# Altium project Z1_Project.PrjPCB
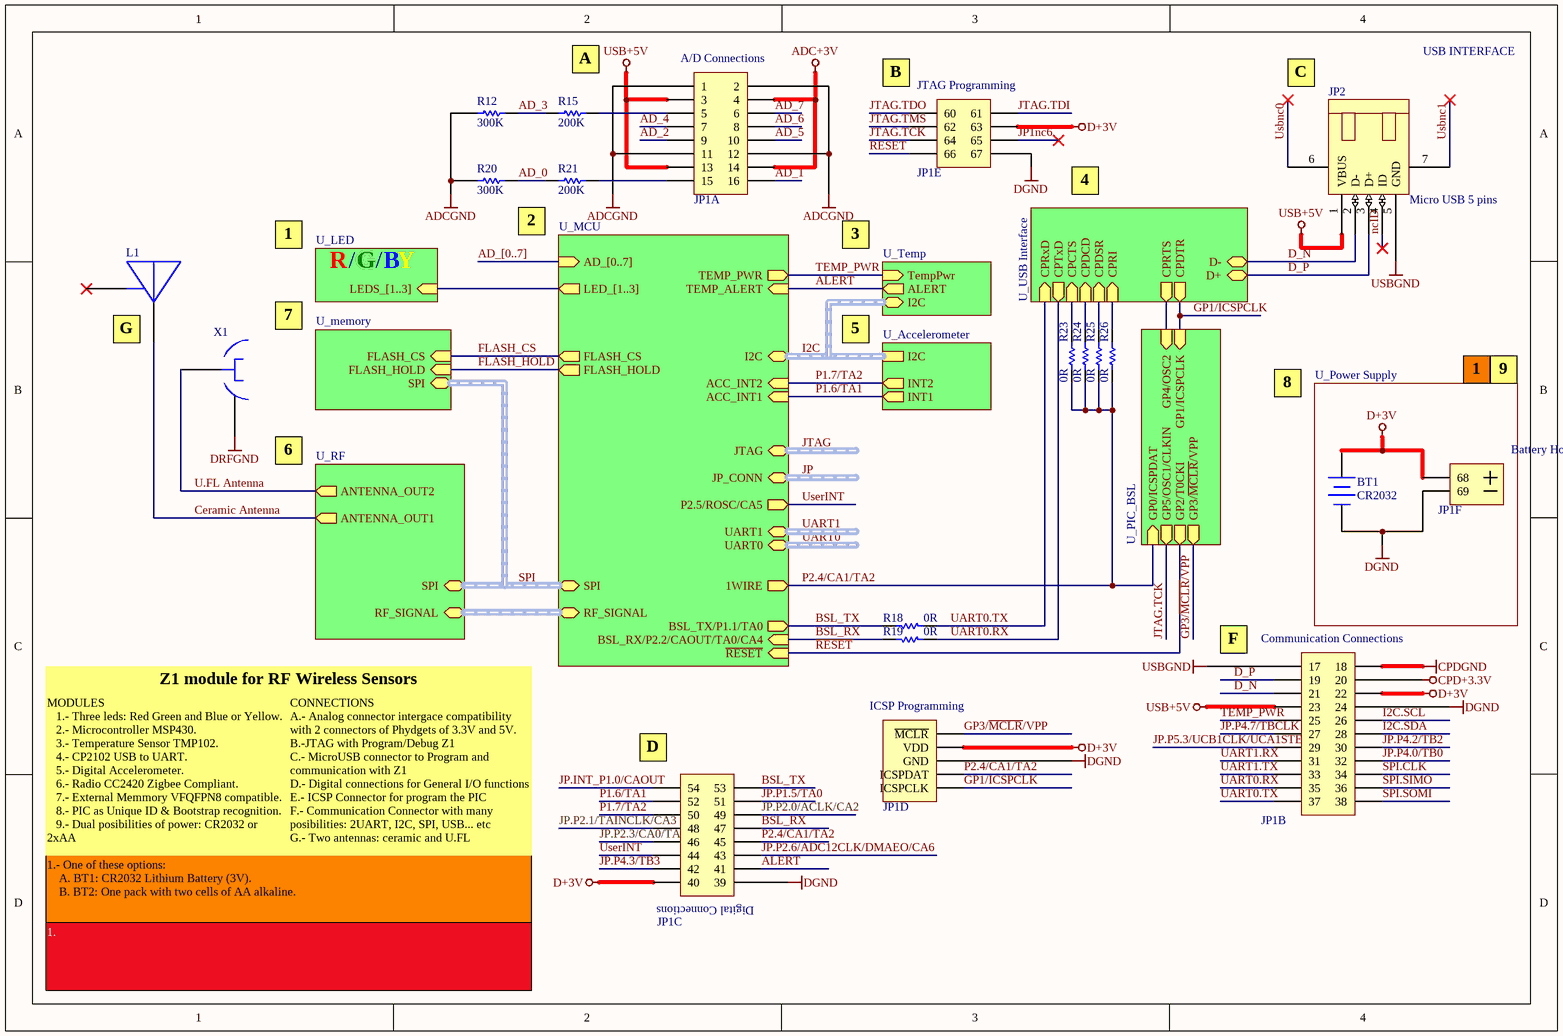
[diagram p0: Main Board.SchDoc]
10 sheets, 106 parts. Net scope: hierarchical (ports join the sheet entries above them; power ports are global).
Board file: Z1.PcbDoc
Sheets:
  Main Board.SchDoc
    U_RF = RF.SchDoc
    U_LED = LED.SchDoc
    U_memory = memory.SchDoc
    U_MCU = MCU.SchDoc
    U_Temp = Temp.SchDoc
    U_USB Interface = USB Interface.SchDoc
    U_Accelerometer = Accelerometer.SchDoc
    U_PIC_BSL = PIC_BSL.SchDoc
    U_Power Supply = Power Supply.SchDoc

## Sheet Main Board.SchDoc: Main Board
size A4; SheetNumber: 1; SheetTotal: 10; Project: WSN Z1; Comments: Main board; PageSetup: Record=PageOptions|CenterHorizontal=True|CenterVertical=True|PrintScale=0.97|XCorrection=1.00|YCorrection=1.00|PrintKind=1|BorderSize=5000000|LeftOffset=0|BottomOffset=0|Orientation=2|PaperLength=2970|PaperWidth=2100|Scale=100|PaperSource=7|PrintQuality=1200|MediaType=1|DitherType=10|PaperKind=A4|PrintScaleMode=1

### Parts
BT1  CR2032  [CR2032 - 796136-1]
JP1  Z1 Expansion Connector  [Z1 Expansion Connectors_RC2]  (value not drawn)  (parts A,B,C,D,E,F of 6)
JP2  Micro USB 5 pins  [ZX62D-B-5P8]
L1  Ceramic Antenna  [YAGEO - CAW431115300245]  (value not drawn)
R12  value 300K  [CR1005-0402]  (hidden comment: Res Semi)
R15  value 200K  [CR1005-0402]  (hidden comment: Res Semi)
R18  value 0R  [CR-0402-AL]  (hidden comment: Res Semi)
R19  value 0R  [CR-0402-AL]  (hidden comment: Res Semi)
R20  value 300K  [CR1005-0402]  (hidden comment: Res Semi)
R21  value 200K  [CR1005-0402]  (hidden comment: Res Semi)
R23  value 0R  [CR-0402-AL]  (hidden comment: Res Semi)
R24  value 0R  [CR-0402-AL]  (hidden comment: Res Semi)
R25  value 0R  [CR-0402-AL]  (hidden comment: Res Semi)
R26  value 0R  [CR-0402-AL]  (hidden comment: Res Semi)
X1  U.FL RF Connector  [U.FL]  (value not drawn)

### Sub-sheets
U_Accelerometer = Accelerometer.SchDoc: INT1 (out), INT2 (out), I2C (harness I2C)
U_LED = LED.SchDoc: LEDS_[1..3] (in)
U_MCU = MCU.SchDoc: 1WIRE (out), TEMP_ALERT (in), ACC_INT1 (in), ACC_INT2 (in), FLASH_CS (out), FLASH_HOLD (out), BSL_TX/P1.1/TA0 (out), BSL_RX/P2.2/CAOUT/TA0/CA4 (in), I2C (harness I2C), UART0 (harness UART0), UART1 (harness UART1), JTAG (harness JTAG), TEMP_PWR (out), ~{RESET} (in), AD_[0..7] (in), SPI (harness SPI), P2.5/ROSC/CA5 (out), LED_[1..3] (out), RF_SIGNAL (harness RADIO), JP_CONN (harness JP_CONN)
U_memory = memory.SchDoc: FLASH_CS (in), FLASH_HOLD (in), SPI (harness SPI)
U_PIC_BSL = PIC_BSL.SchDoc: GP0/ICSPDAT (in), GP2/T0CKI (out), GP1/ICSPCLK (in), GP4/OSC2 (in), GP5/OSC1/CLKIN (out), GP3/~{MCLR}/VPP (out)
U_Power Supply = Power Supply.SchDoc: no entries
U_RF = RF.SchDoc: ANTENNA_OUT2 (out), SPI (harness SPI), RF_SIGNAL (harness RADIO), ANTENNA_OUT1 (out)
U_Temp = Temp.SchDoc: ALERT (out), I2C (harness I2C), TempPwr (in)
U_USB Interface = USB Interface.SchDoc: CPRxD (in), CPTxD (out), CPRTS (out), CPCTS (in), CPDSR (in), CPDCD (in), CPDTR (out), CPRI (in), D- (bidir), D+ (bidir)

### Nets
ADC+3V: JP1.4 JP1.14
ADCGND: JP1.1 JP1.2 JP1.11 JP1.12 R12.2 R20.2
CPD+3.3V: JP1.20
CPDGND: JP1.18
D+3V: BT1.1(+) JP1.22 JP1.40 JP1.56(VDD) JP1.63 JP1.68
DGND: BT1.2(-) JP1.24 JP1.39 JP1.57(GND) JP1.67 JP1.69
DRFGND: X1.2(GND)
USB+5V: JP1.3 JP1.13 JP1.23 JP2.1(VBUS)
USBGND: JP1.17 JP2.5(GND)
AD_0: R20.1 R21.2
AD_1: JP1.16
AD_2: JP1.9
AD_3: R12.1 R15.2
AD_4: JP1.7
AD_5: JP1.10
AD_6: JP1.8
AD_7: JP1.6
ALERT: JP1.41 ; sheet U_MCU/TEMP_ALERT, sheet U_Temp/ALERT
BSL_RX: JP1.47 R19.2 ; sheet U_MCU/BSL_RX/P2.2/CAOUT/TA0/CA4
BSL_TX: JP1.53 R18.2 ; sheet U_MCU/BSL_TX/P1.1/TA0
Ceramic Antenna: L1.1(+) ; sheet U_RF/ANTENNA_OUT1
CPCTS: R23.1 ; sheet U_USB Interface/CPCTS
CPDCD: R24.1 ; sheet U_USB Interface/CPDCD
CPDSR: R25.1 ; sheet U_USB Interface/CPDSR
CPRI: R26.1 ; sheet U_USB Interface/CPRI
CPRTS: sheet U_USB Interface/CPRTS, sheet U_PIC_BSL/GP4/OSC2
D_N: JP1.21 JP2.2(D-) ; sheet U_USB Interface/D-
D_P: JP1.19 JP2.3(D+) ; sheet U_USB Interface/D+
FLASH_CS: sheet U_memory/FLASH_CS, sheet U_MCU/FLASH_CS
FLASH_HOLD: sheet U_memory/FLASH_HOLD, sheet U_MCU/FLASH_HOLD
GP1/ICSPCLK: JP1.59(ICSPCLK) ; sheet U_USB Interface/CPDTR, sheet U_PIC_BSL/GP1/ICSPCLK  [project net CPDTR]
GP3/~{MCLR}/VPP: JP1.55(~{MCLR}) ; sheet U_PIC_BSL/GP3/~{MCLR}/VPP
I2C.SCL: JP1.26
I2C.SDA: JP1.28
JP1nc6: JP1.65
JP.INT_P1.0/CAOUT: JP1.54
JP.P1.5/TA0: JP1.51
JP.P2.0/ACLK/CA2: JP1.49
JP.P2.1/TAINCLK/CA3: JP1.48
JP.P2.3/CA0/TA1: JP1.46
JP.P2.6/ADC12CLK/DMAEO/CA6: JP1.43
JP.P4.0/TB0: JP1.32
JP.P4.2/TB2: JP1.30
JP.P4.3/TB3: JP1.42
JP.P4.7/TBCLK: JP1.27
JP.P5.3/UCB1CLK/UCA1STE: JP1.29
JTAG.TCK: JP1.64 ; sheet U_PIC_BSL/GP5/OSC1/CLKIN  [project net GP5/OSC1/CLKIN]
JTAG.TDI: JP1.61
JTAG.TDO: JP1.60
JTAG.TMS: JP1.62
ncID: JP2.4(ID)
P1.6/TA1: JP1.52 ; sheet U_MCU/ACC_INT1, sheet U_Accelerometer/INT1  [project net INT1]
P1.7/TA2: JP1.50 ; sheet U_MCU/ACC_INT2, sheet U_Accelerometer/INT2  [project net INT2]
P2.4/CA1/TA2: JP1.45 JP1.58(ICSPDAT) R23.2 R24.2 R25.2 R26.2 ; sheet U_MCU/1WIRE, sheet U_PIC_BSL/GP0/ICSPDAT  [project net GP0/ICSPDAT]
~{RESET}: JP1.66 ; sheet U_MCU/~{RESET}, sheet U_PIC_BSL/GP2/T0CKI  [project net GP2/T0CKI]
SPI.CLK: JP1.34
SPI.SIMO: JP1.36
SPI.SOMI: JP1.38
TEMP_PWR: JP1.25 ; sheet U_MCU/TEMP_PWR, sheet U_Temp/TempPwr  [project net P5.0/UCB1STE/UCA1CLK]
U.FL Antenna: X1.1(+) ; sheet U_RF/ANTENNA_OUT2
UART0.RX: JP1.35 R19.1 ; sheet U_USB Interface/CPTxD  [project net CPTxD]
UART0.TX: JP1.37 R18.1 ; sheet U_USB Interface/CPRxD  [project net CPRxD]
UART1.RX: JP1.31
UART1.TX: JP1.33
Usbnc0: JP2.6(SH2)
Usbnc1: JP2.7(SH1)
UserINT: JP1.44 ; sheet U_MCU/P2.5/ROSC/CA5  [project net P2.5/ROSC/CA5]
NetJP1_5: JP1.5 R15.1
NetJP1_15: JP1.15 R21.1

Not connected (* = marked no-connect by the designer): L1 2(GND)*

### Buses and harness runs
bus AD_[0..7] = sheet U_MCU/AD_[0..7]
bus sheet U_LED/LEDS_[1..3] = sheet U_MCU/LED_[1..3]
harness I2C = sheet U_Accelerometer/I2C = sheet U_MCU/I2C = sheet U_Temp/I2C
harness JP = sheet U_MCU/JP_CONN
harness JTAG = sheet U_MCU/JTAG
harness sheet U_MCU/RF_SIGNAL = sheet U_RF/RF_SIGNAL
harness SPI = sheet U_MCU/SPI = sheet U_memory/SPI = sheet U_RF/SPI
harness UART0 = sheet U_MCU/UART0
harness UART1 = sheet U_MCU/UART1

### Notes on the sheet
- (near R15) A
- (near JP1) B
- C
- USB INTERFACE
- 1
- 2
- 3
- 4
- R
- /
- G
- B
- Y
- (near L1) G
- 7
- 5
- 9
- 8
- 6
- F
- Z1 module for RF Wireless Sensors
- (near JP1) D
- (near JP1) E
- MODULES
  1.- Three leds: Red Green and Blue or Yellow.
  2.- Microcontroller MSP430.
  3.- Temperature Sensor TMP102.
  4.- CP2102 USB to UART.
  5.- Digital Accelerometer.
  6.- Radio CC2420 Zigbee Compliant.
  7.- External Memmory VFQFPN8 compatible.
  8.- PIC as Unique ID & Bootstrap recognition.
  9.- Dual posibilities of power: CR2032 or 2xAA
- CONNECTIONS
  A.- Analog connector intergace compatibility with 2 connectors of Phydgets of 3.3V and 5V.
  B.-JTAG with Program/Debug Z1
  C.- MicroUSB connector to Program and communication with Z1
  D.- Digital connections for General I/O functions
  E.- ICSP Connector for program the PIC
  F.- Communication Connector with many posibilities: 2UART, I2C, SPI, USB... etc
  G.- Two antennas: ceramic and U.FL
- 1.- One of these options:
  A. BT1: CR2032 Lithium Battery (3V).
  B. BT2: One pack with two cells of AA alkaline.
- 1.
- (in symbol Z1_RC1, part A) A/D Connections
- (in symbol Z1_RC1, part B) Communication Connections
- (in symbol Z1_RC1, part C) Digital Connections
- (in symbol Z1_RC1, part D) ICSP Programming
- (in symbol Z1_RC1, part E) JTAG Programming
- (in symbol Z1_RC1, part F) Battery Holder

### Library data of the parts
BT1 = Battery: Multicell Battery; Value: +3.3V
JP1 = Z1_RC1
JP2 = USB 5 pins
L1 = 5.3x2.2 TDMA Antenna_1: ANT 2.4GHZ 802.11 BLUETOOTH SMD
R12 R15 R20 R21 R23-R26 = Res Semi: Semiconductor Resistor; Manufacturer: Generic Components
R18 R19 = Res Semi: RES ZERO OHM 1/10W 5% 0402 SMD
X1 = AntennaOmnidirectional: CONN RF MICROCOAXIAL SMD GOLD

## Sheet RF.SchDoc: Radio Frequency Module
size A4; SheetNumber: 3; SheetTotal: 10; Project: WSN Z1; Comments: RF Module; CurrentDate: 25/02/2008
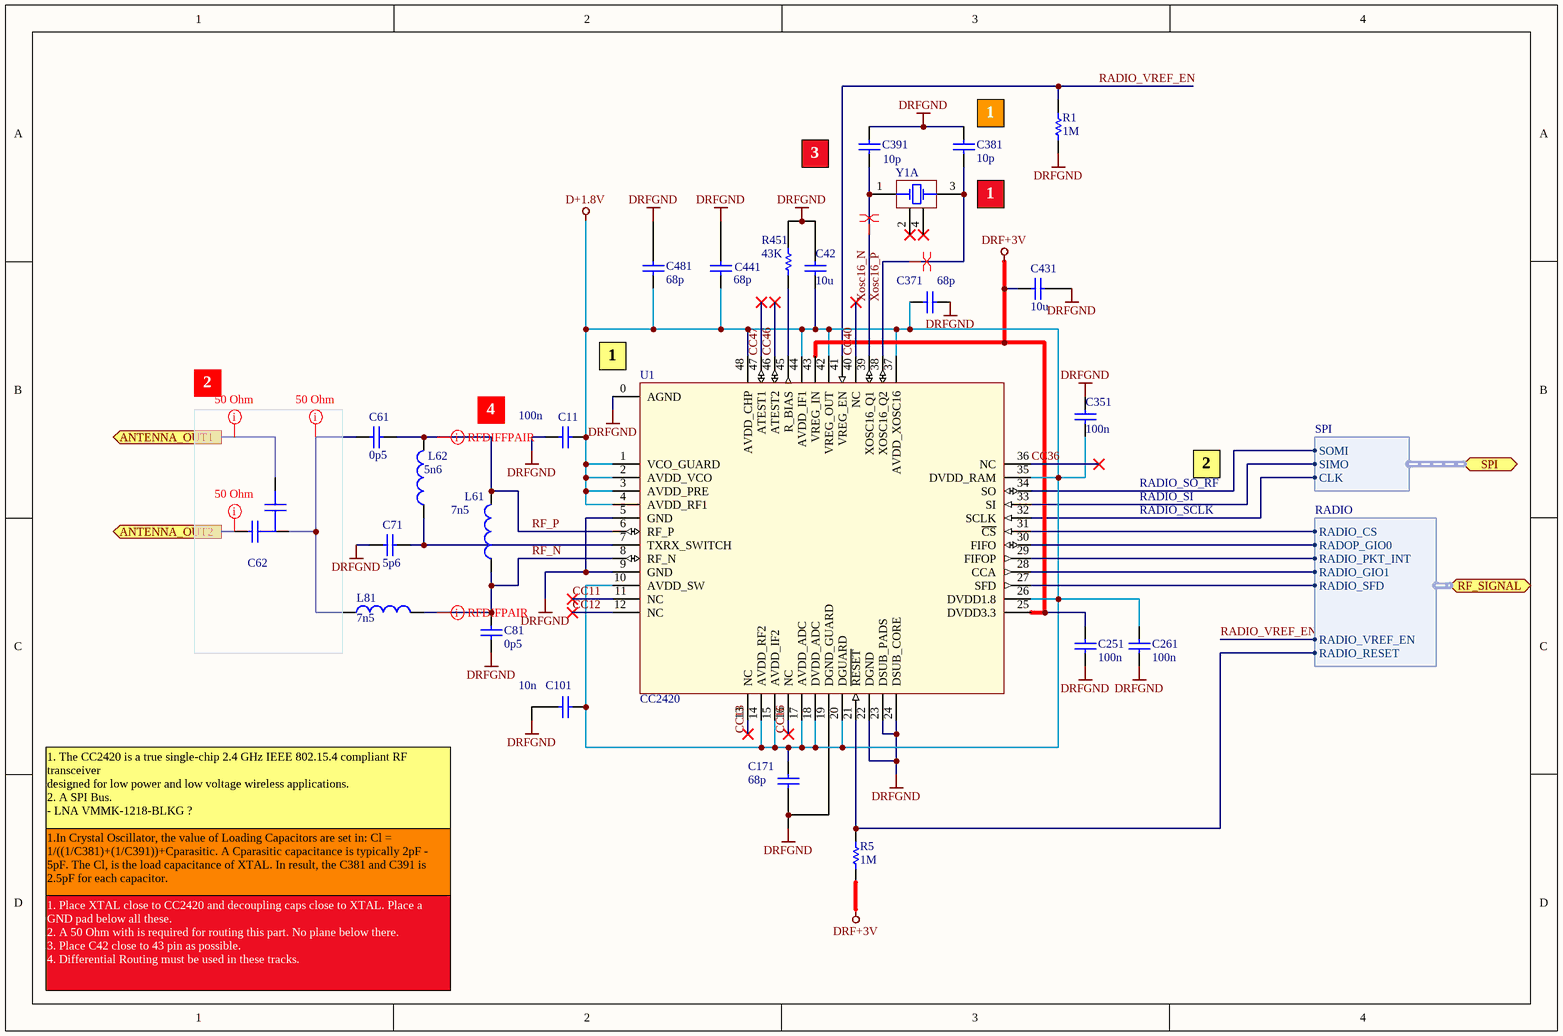
[diagram p1: RF.SchDoc]

### Parts
C11  value 100n  [CC-0402-AL]  (hidden comment: Cap Semi)
C42  value 10u  [CC2013-0805]  (hidden comment: Cap Semi)
C61  value 0p5  [CC-0402-AL]  (hidden comment: Cap Semi)
C62  Bilateral Switch Capacitor  [Dual Capacitor Switch]  (value not drawn)
C71  value 5p6  [CC-0402-AL]  (hidden comment: Cap Semi)
C81  value 0p5  [CC-0402-AL]  (hidden comment: Cap Semi)
C101  value 10n  [CC-0402-AL]  (hidden comment: Cap Semi)
C171  value 68p  [CC-0402-AL]  (hidden comment: Cap Semi)
C251  value 100n  [CC-0402-AL]  (hidden comment: Cap Semi)
C261  value 100n  [CC-0402-AL]  (hidden comment: Cap Semi)
C351  value 100n  [CC-0402-AL]  (hidden comment: Cap Semi)
C371  value 68p  [CC-0402-AL]  (hidden comment: Cap Semi)
C381  value 10p  [CC-0402-AL]  (hidden comment: Cap Semi)
C391  value 10p  [CC-0402-AL]  (hidden comment: Cap Semi)
C431  value 10u  [CC2013-0805]  (hidden comment: Cap Semi)
C441  value 68p  [CC-0402-AL]  (hidden comment: Cap Semi)
C481  value 68p  [CC-0402-AL]  (hidden comment: Cap Semi)
L61  value 7n5  [INDC1005-0402-ALT]  (hidden comment: Inductor)
L62  value 5n6  [INDC1005-0402]  (hidden comment: Inductor)
L81  value 7n5  [INDC1005-0402]  (hidden comment: Inductor)
R1  value 1M  [CR-0402-AL]  (hidden comment: Res Semi)
R5  value 1M  [CR-0402-AL]  (hidden comment: Res Semi)
R451  value 43K  [CR-0402-AL]  (hidden comment: Res Semi)
U1  CC2420  [QFN7X7-48]
Y1  XTAL 4pins  [NX3225SA- 16.000000Hhz-B3]  (value not drawn)  (part A of 2)

### Ports
ANTENNA_OUT1 (out), ANTENNA_OUT2 (out), RF_SIGNAL (harness RADIO), SPI (harness SPI)

### Harnesses
SPI: CLK, SOMI, SIMO
RADIO: RADIO_RESET, RADIO_VREF_EN, RADIO_SFD, RADIO_PKT_INT, RADOP_GIO0, RADIO_GIO1, RADIO_CS

### Nets
D+1.8V: C11.2 C42.1 C101.2 C171.1 C261.1 C351.1 C371.1 C441.1 C481.1 U1.1(VCO_GUARD) U1.2(AVDD_VCO) U1.3(AVDD_PRE) U1.4(AVDD_RF1) U1.10(AVDD_SW) U1.14(AVDD_RF2) U1.15(AVDD_IF2) U1.17(AVDD_ADC) U1.18(DVDD_ADC) U1.20(DGUARD) U1.26(DVDD1.8) U1.35(DVDD_RAM) U1.37(AVDD_XOSC16) U1.42(VREG_OUT) U1.44(AVDD_IF1) U1.48(AVDD_CHP)
DRF+3V: C251.1 C431.2 R5.1 U1.25(DVDD3.3) U1.43(VREG_IN)
DRFGND: C11.1 C42.2 C71.2 C81.1 C101.1 C171.2 C251.2 C261.2 C351.2 C371.2 C381.2 C391.2 C431.1 C441.2 C481.2 R1.1 R451.2 U1.0(AGND) U1.5(GND) U1.9(GND) U1.19(DGND_GUARD) U1.22(DGND) U1.23(DSUB_PADS) U1.24(DSUB_CORE)
CC11: U1.11(NC)
CC12: U1.12(NC)
CC13: U1.13(NC)
CC16: U1.16(NC)
CC36: U1.36(NC)
CC40: U1.40(NC)
CC46: U1.46(ATEST2)
CC47: U1.47(ATEST1)
Ceramic Antenna: C62.3 ; port ANTENNA_OUT1
P1.2/TA1: U1.29(FIFOP) ; port RF_SIGNAL.RADIO_PKT_INT
P1.3/TA2: U1.30(FIFO) ; port RF_SIGNAL.RADOP_GIO0
P1.4/SMCLK: U1.28(CCA) ; port RF_SIGNAL.RADIO_GIO1
P3.0/UCB0STE/UCA0CLK: U1.31(~{CS}) ; port RF_SIGNAL.RADIO_CS
P3.1/UCB0SIMO/UCB0SDA: U1.33(SI) ; port SPI.SIMO
P3.2/UCB0SOMI/UCB0SCL: U1.34(SO) ; port SPI.SOMI
P3.3/UCB0CLK/UCA0STE: U1.32(SCLK) ; port SPI.CLK
P4.1/TB1: U1.27(SFD) ; port RF_SIGNAL.RADIO_SFD
P4.6/TB6: R5.2 U1.21(~{RESET}) ; port RF_SIGNAL.RADIO_RESET
RADIO_VREF_EN: R1.2 U1.41(VREG_EN) ; port RF_SIGNAL.RADIO_VREF_EN  [project net P4.5/TB5]
RF_N: C81.2 L61.1 L81.2 U1.8(RF_N)
RF_P: C61.1 L61.2 L62.2 U1.6(RF_P)
U.FL Antenna: C62.2 ; port ANTENNA_OUT2
Xosc16_N: C391.1 U1.39(XOSC16_Q1) Y1.1(OSC1)
Xosc16_P: C381.1 U1.38(XOSC16_Q2) Y1.3(OSC2)
NetC61_2: C61.2 C62.1 L81.1
NetC71_1: C71.1 L62.1 U1.7(TXRX_SWITCH)
NetR451_1: R451.1 U1.45(R_BIAS)

Not connected (* = marked no-connect by the designer): Y1 2(GND)* 4(GND)*

### Layout directives
differential pair; rule Differential Pairs Routing [Pref Gap = 0.254mm    Min Gap  = 0.15mm    Max Gap  = 0.5mm]: RF_N, RF_P, Xosc16_N, Xosc16_P
rule Width Constraint [Pref Width = 0.254mm    Min Width = 0.01mm    Max Width = 3mm]: Ceramic Antenna, NetC61_2, U.FL Antenna

### Notes on the sheet
- (near C391) 3
- (near C381) 1
- 1
- (near U1) 1
- 2
- 4
- RADIO_SCLK
- RADIO_SI
- RADIO_SO_RF
- 1. The CC2420 is a true single-chip 2.4 GHz IEEE 802.15.4 compliant RF transceiver
  designed for low power and low voltage wireless applications.
  2. A SPI Bus.
  - LNA VMMK-1218-BLKG ?
- 1.In Crystal Oscillator, the value of Loading Capacitors are set in: Cl = 1/((1/C381)+(1/C391))+Cparasitic. A Cparasitic capacitance is typically 2pF - 5pF. The Cl, is the load capacitance of XTAL. In result, the C381 and C391 is 2.5pF for each capacitor.
- 1. Place XTAL close to CC2420 and decoupling caps close to XTAL. Place a GND pad below all these.
  2. A 50 Ohm with is required for routing this part. No plane below there.
  3. Place C42 close to 43 pin as possible.
  4. Differential Routing must be used in these tracks.

### Library data of the parts
C11 C42 C61 C71 C81 C101 C171 C251 C261 C351 C371 C381 C391 C431 C441 C481 = Cap Semi: Capacitor (Semiconductor SIM Model)
C62 = Bilateral Switch Capacitor: Value: 5p6
R1 R5 = Res Semi: as R12 on sheet Main Board
R451 = Res Semi: RES 43.0K OHM 1/16W 1% 0402 SMD; Manufacturer: Generic Components
U1 = CC2420: 2.4 GHz IEEE 802.15.4 / ZigBee-ready RF Transceiver
Y1 = XTAL 4pins: XTAL 7.2pF Load Capacitance.; Manufacturer: Generic Components; Value: 16Mhz

## Sheet LED.SchDoc: Led Interface
size A4; SheetNumber: 7; SheetTotal: 10; Project: WSN Z1; Comments: Led Interface
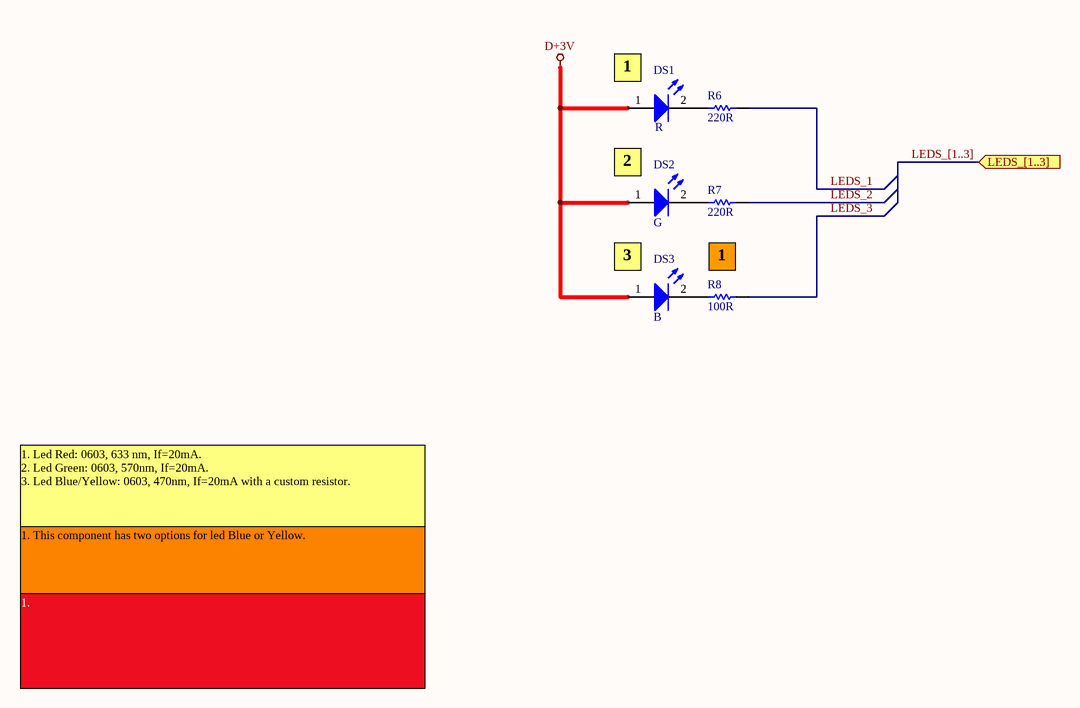
[diagram p2: LED.SchDoc]

### Parts
DS1  R  [LED0603]
DS2  G  [LED0603]
DS3  B  [LED0603]
R6  value 220R  [CR-0402-AL]  (hidden comment: Res Semi)
R7  value 220R  [CR-0402-AL]  (hidden comment: Res Semi)
R8  value 100R  [CR-0402-AL]  (hidden comment: Res Semi)

### Ports
LEDS_[1..3] (in)

### Nets
D+3V: DS1.1(A) DS2.1(A) DS3.1(A)
LEDS_1: R6.1  [project net LED1]
LEDS_2: R7.2  [project net LED2]
LEDS_3: R8.2  [project net LED3]
NetDS1_2: DS1.2(K) R6.2
NetDS2_2: DS2.2(K) R7.1
NetDS3_2: DS3.2(K) R8.1

### Buses and harness runs
bus LEDS_[1..3] = port LEDS_[1..3]

### Notes on the sheet
- (near DS1) 1
- 2
- 3
- 1
- 1. Led Red: 0603, 633 nm, If=20mA.
  2. Led Green: 0603, 570nm, If=20mA.
  3. Led Blue/Yellow: 0603, 470nm, If=20mA with a custom resistor.
- 1. This component has two options for led Blue or Yellow.
- 1.

### Library data of the parts
DS1 = LED2: LED 1.6X0.8MM 631NM RED CLR SMD
DS2 = LED2: LED CHIPLED 570NM GREEN 0603 SMD
DS3 = LED2: LED 1.6X0.8MM 470NM BLUE CLR SMD
R6-R8 = Res Semi: as R12 on sheet Main Board

## Sheet memory.SchDoc: Memmory interface
size A4; SheetNumber: 10; SheetTotal: 10; Project: WSN Z1; Comments: M25P* EEPROMS
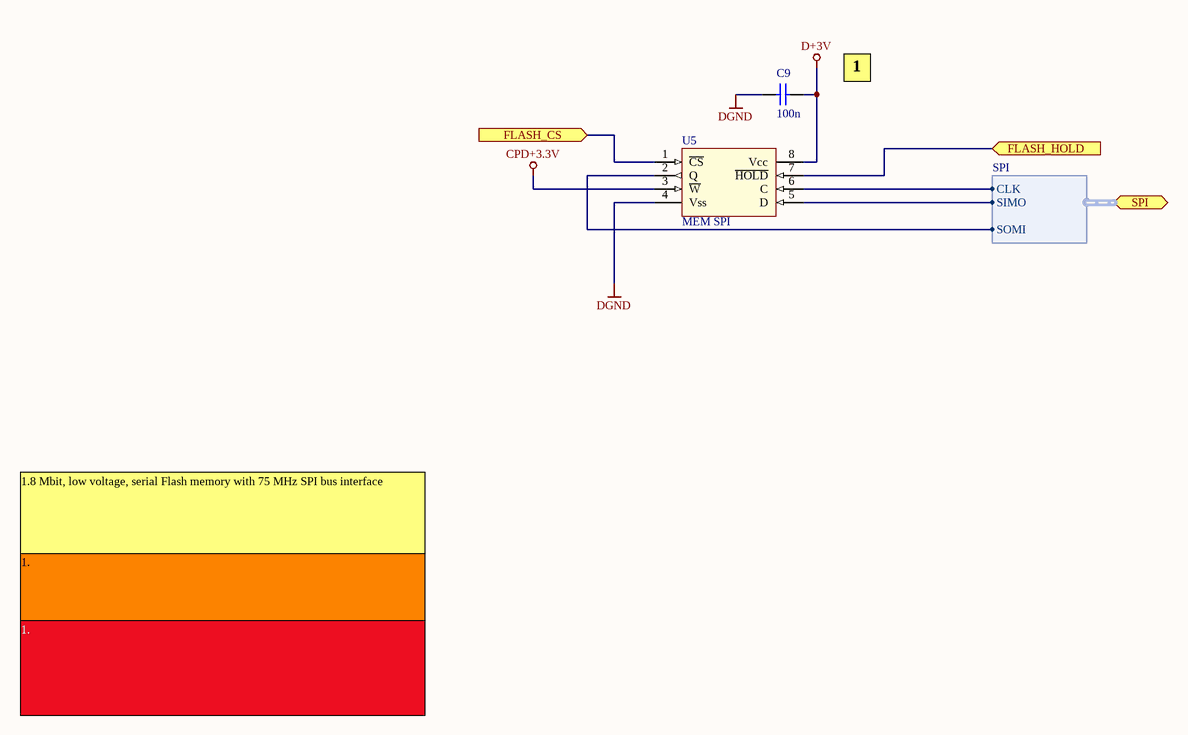
[diagram p3: memory.SchDoc]

### Parts
C9  value 100n  [CC-0402-AL]  (hidden comment: Cap Semi)
U5  MEM SPI  [VFQFPN8]

### Ports
FLASH_CS (in), FLASH_HOLD (in), SPI (harness SPI)

### Harnesses
SPI: CLK, SOMI, SIMO

### Nets
CPD+3.3V: U5.3(~{W})
D+3V: C9.2 U5.8(Vcc)
DGND: C9.1 U5.4(Vss)
FLASH_CS: U5.1(~{CS}) ; port FLASH_CS
FLASH_HOLD: U5.7(~{HOLD}) ; port FLASH_HOLD
P3.1/UCB0SIMO/UCB0SDA: U5.5(D) ; port SPI.SIMO
P3.2/UCB0SOMI/UCB0SCL: U5.2(Q) ; port SPI.SOMI
P3.3/UCB0CLK/UCA0STE: U5.6(C) ; port SPI.CLK

### Notes on the sheet
- 1
- 1.8 Mbit, low voltage, serial Flash memory with 75 MHz SPI bus interface
- 1.

### Library data of the parts
C9 = Cap Semi: Capacitor (Semiconductor SIM Model)
U5 = M25P80: 8 Mbit, low voltage, serial Flash memory  with 75 MHz SPI bus interface

## Sheet MCU.SchDoc: Microcontroller
size A4; SheetNumber: 2; SheetTotal: 10; Project: WSN Z1; Comments: MSP430 16-Bit; PageSetup: Record=PageOptions|CenterHorizontal=True|CenterVertical=True|PrintScale=0.97|XCorrection=1.00|YCorrection=1.00|PrintKind=1|BorderSize=5000000|LeftOffset=0|BottomOffset=0|Orientation=2|PaperLength=2970|PaperWidth=2100|Scale=100|PaperSource=7|PrintQuality=1200|MediaType=1|DitherType=10|PaperKind=A4|PrintScaleMode=1
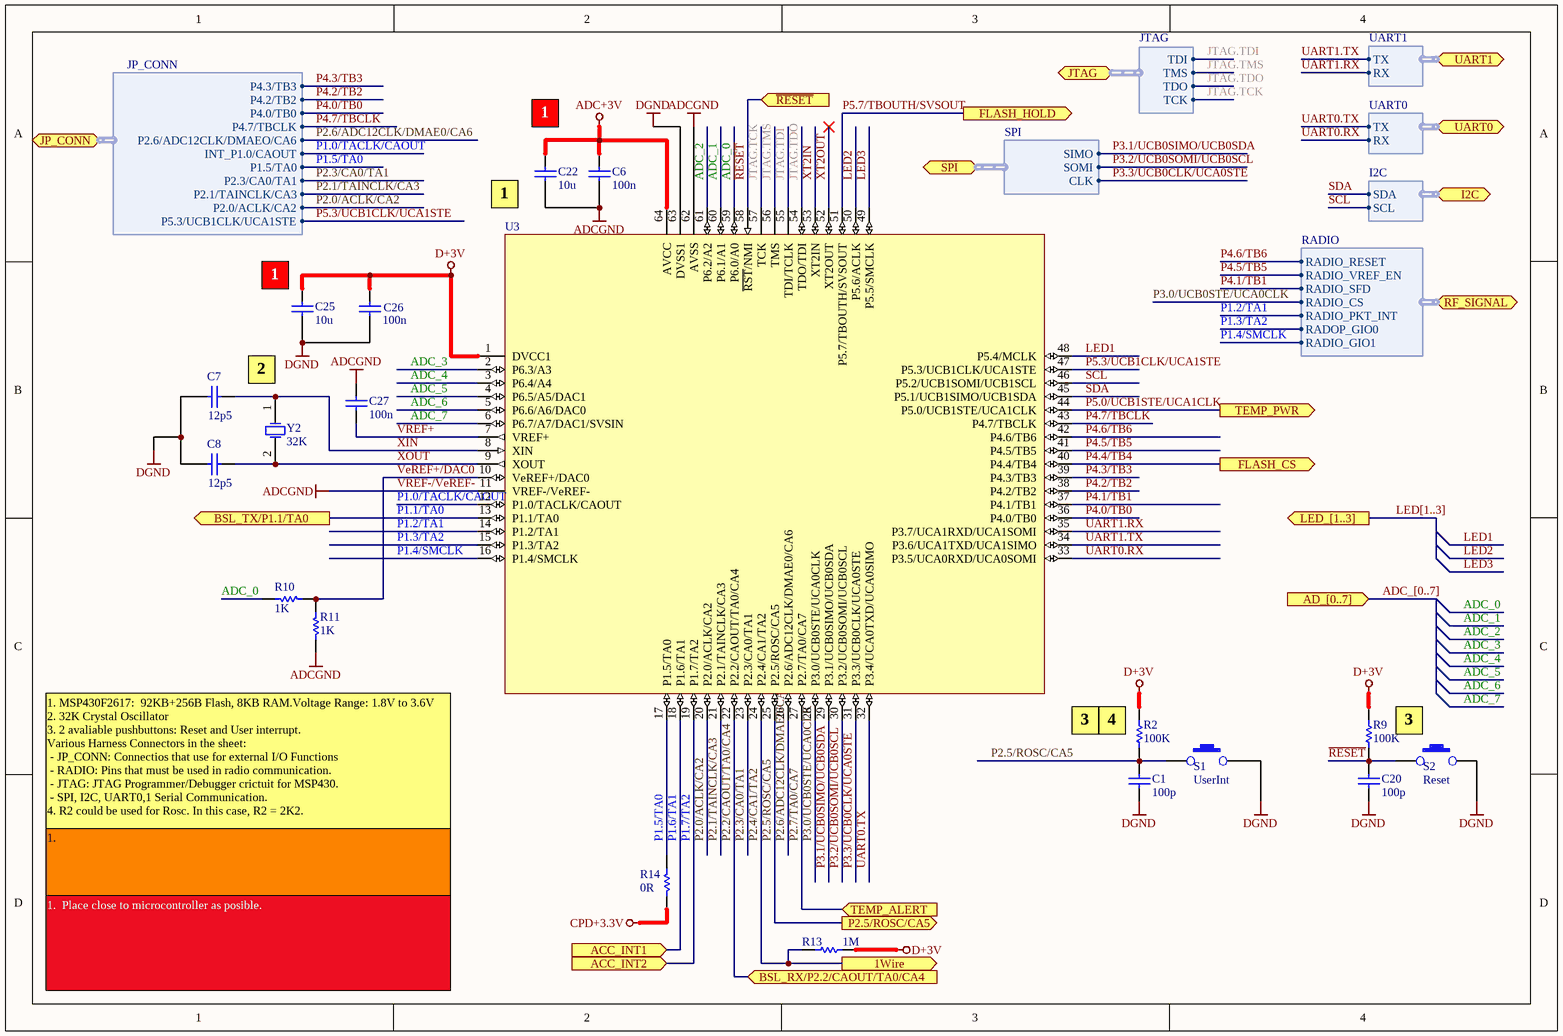
[diagram p4: MCU.SchDoc]

### Parts
C1  value 100p  [CC-0402-AL]  (hidden comment: Cap Semi)
C6  value 100n  [CC-0402-AL]  (hidden comment: Cap Semi)
C7  value 12p5  [CC-0402-AL]  (hidden comment: Cap Semi)
C8  value 12p5  [CC-0402-AL]  (hidden comment: Cap Semi)
C20  value 100p  [CC-0402-AL]  (hidden comment: Cap Semi)
C22  value 10u  [CC1608-0603]  (hidden comment: Cap Semi)
C25  value 10u  [CC1608-0603]  (hidden comment: Cap Semi)
C26  value 100n  [CC-0402-AL]  (hidden comment: Cap Semi)
C27  value 100n  [CC-0402-AL]  (hidden comment: Cap Semi)
R2  value 100K  [CR1005-0402]  (hidden comment: Res Semi)
R9  value 100K  [CR-0402-AL]  (hidden comment: Res Semi)
R10  value 1K  [CR-0402-AL]  (hidden comment: Res Semi)
R11  value 1K  [CR-0402-AL]  (hidden comment: Res Semi)
R13  value 1M  [CR-0402-AL]  (hidden comment: Res Semi)
R14  value 0R  [CR-0402-AL]  (hidden comment: Res Semi)
S1  UserInt  [B3U-1000P]
S2  Reset  [B3U-1000P]
U3  MSP430F2617TPMR  [F-QFP10x10-G64/N]  (value not drawn)
Y2  32K  [ABS07-32.768KHZ-7-T]

### Ports
1Wire (out), ACC_INT1 (in), ACC_INT2 (in), AD_[0..7] (in), BSL_RX/P2.2/CAOUT/TA0/CA4 (in), BSL_TX/P1.1/TA0 (out), FLASH_CS (out), FLASH_HOLD (out), I2C (harness I2C), JP_CONN (harness JP_CONN), JTAG (harness JTAG), LED_[1..3] (out), P2.5/ROSC/CA5 (out), RF_SIGNAL (harness RADIO), SPI (harness SPI), TEMP_ALERT (in), TEMP_PWR (out), UART0 (harness UART0), UART1 (harness UART1), ~{RESET} (in)

### Harnesses
I2C: SCL, SDA
UART0: RX, TX
UART1: RX, TX
JTAG: TCK, TDI, TDO, TMS
SPI: CLK, SOMI, SIMO
RADIO: RADIO_RESET, RADIO_VREF_EN, RADIO_SFD, RADIO_PKT_INT, RADOP_GIO0, RADIO_GIO1, RADIO_CS
JP_CONN: P2.0/ACLK/CA2, P2.1/TAINCLK/CA3, P2.3/CA0/TA1, P1.5/TA0, INT_P1.0/CAOUT, P2.6/ADC12CLK/DMAEO/CA6, P4.7/TBCLK, P4.0/TB0, P4.2/TB2, P4.3/TB3, P5.3/UCB1CLK/UCA1STE

### Nets
ADC+3V: C6.1 C22.1 U3.64(AVCC)
ADCGND: C6.2 C22.2 C27.1 R11.1 U3.11(VREF-/VeREF-) U3.62(AVSS)
CPD+3.3V: R14.1
D+3V: C25.1 C26.1 R2.1 R9.2 R13.1 U3.1(DVCC1)
DGND: C1.2 C7.1 C8.1 C20.2 C25.2 C26.2 S1.2 S2.2 U3.63(DVSS1)
ADC_0: R10.2 U3.59(P6.0/A0)  [project net AD_0]
ADC_1: U3.60(P6.1/A1)  [project net AD_1]
ADC_2: U3.61(P6.2/A2)  [project net AD_2]
ADC_3: U3.2(P6.3/A3)  [project net AD_3]
ADC_4: U3.3(P6.4/A4)  [project net AD_4]
ADC_5: U3.4(P6.5/A5/DAC1)  [project net AD_5]
ADC_6: U3.5(P6.6/A6/DAC0)  [project net AD_6]
ADC_7: U3.6(P6.7/A7/DAC1/SVSIN)  [project net AD_7]
JTAG.TCK: U3.57(TCK) ; port JTAG.TCK
JTAG.TDI: U3.55(TDI/TCLK) ; port JTAG.TDI
JTAG.TDO: U3.54(TDO/TDI) ; port JTAG.TDO
JTAG.TMS: U3.56(TMS) ; port JTAG.TMS
LED1: U3.48(P5.4/MCLK)
LED2: U3.50(P5.6/ACLK)
LED3: U3.49(P5.5/SMCLK)
P1.0/TACLK/CAOUT: U3.12(P1.0/TACLK/CAOUT) ; port JP_CONN.INT_P1.0/CAOUT  [project net JP.INT_P1.0/CAOUT]
P1.1/TA0: U3.13(P1.1/TA0) ; port BSL_TX/P1.1/TA0  [project net BSL_TX]
P1.2/TA1: U3.14(P1.2/TA1) ; port RF_SIGNAL.RADIO_PKT_INT
P1.3/TA2: U3.15(P1.3/TA2) ; port RF_SIGNAL.RADOP_GIO0
P1.4/SMCLK: U3.16(P1.4/SMCLK) ; port RF_SIGNAL.RADIO_GIO1
P1.5/TA0: R14.2 U3.17(P1.5/TA0) ; port JP_CONN.P1.5/TA0  [project net JP.P1.5/TA0]
P1.6/TA1: U3.18(P1.6/TA1) ; port ACC_INT1  [project net INT1]
P1.7/TA2: U3.19(P1.7/TA2) ; port ACC_INT2  [project net INT2]
P2.0/ACLK/CA2: U3.20(P2.0/ACLK/CA2) ; port JP_CONN.P2.0/ACLK/CA2  [project net JP.P2.0/ACLK/CA2]
P2.1/TAINCLK/CA3: U3.21(P2.1/TAINCLK/CA3) ; port JP_CONN.P2.1/TAINCLK/CA3  [project net JP.P2.1/TAINCLK/CA3]
P2.2/CAOUT/TA0/CA4: U3.22(P2.2/CAOUT/TA0/CA4) ; port BSL_RX/P2.2/CAOUT/TA0/CA4  [project net BSL_RX]
P2.3/CA0/TA1: U3.23(P2.3/CA0/TA1) ; port JP_CONN.P2.3/CA0/TA1  [project net JP.P2.3/CA0/TA1]
P2.4/CA1/TA2: R13.2 U3.24(P2.4/CA1/TA2) ; port 1Wire  [project net GP0/ICSPDAT]
P2.5/ROSC/CA5: C1.1 R2.2 S1.1 U3.25(P2.5/ROSC/CA5) ; port P2.5/ROSC/CA5
P2.6/ADC12CLK/DMAE0/CA6: U3.26(P2.6/ADC12CLK/DMAE0/CA6) ; port JP_CONN.P2.6/ADC12CLK/DMAEO/CA6  [project net JP.P2.6/ADC12CLK/DMAEO/CA6]
P2.7/TA0/CA7: U3.27(P2.7/TA0/CA7) ; port TEMP_ALERT  [project net ALERT]
P3.0/UCB0STE/UCA0CLK: U3.28(P3.0/UCB0STE/UCA0CLK) ; port RF_SIGNAL.RADIO_CS
P3.1/UCB0SIMO/UCB0SDA: U3.29(P3.1/UCB0SIMO/UCB0SDA) ; port SPI.SIMO
P3.2/UCB0SOMI/UCB0SCL: U3.30(P3.2/UCB0SOMI/UCB0SCL) ; port SPI.SOMI
P3.3/UCB0CLK/UCA0STE: U3.31(P3.3/UCB0CLK/UCA0STE) ; port SPI.CLK
P4.0/TB0: U3.36(P4.0/TB0) ; port JP_CONN.P4.0/TB0  [project net JP.P4.0/TB0]
P4.1/TB1: U3.37(P4.1/TB1) ; port RF_SIGNAL.RADIO_SFD
P4.2/TB2: U3.38(P4.2/TB2) ; port JP_CONN.P4.2/TB2  [project net JP.P4.2/TB2]
P4.3/TB3: U3.39(P4.3/TB3) ; port JP_CONN.P4.3/TB3  [project net JP.P4.3/TB3]
P4.4/TB4: U3.40(P4.4/TB4) ; port FLASH_CS  [project net FLASH_CS]
P4.5/TB5: U3.41(P4.5/TB5) ; port RF_SIGNAL.RADIO_VREF_EN
P4.6/TB6: U3.42(P4.6/TB6) ; port RF_SIGNAL.RADIO_RESET
P4.7/TBCLK: U3.43(P4.7/TBCLK) ; port JP_CONN.P4.7/TBCLK  [project net JP.P4.7/TBCLK]
P5.0/UCB1STE/UCA1CLK: U3.44(P5.0/UCB1STE/UCA1CLK) ; port TEMP_PWR
P5.3/UCB1CLK/UCA1STE: U3.47(P5.3/UCB1CLK/UCA1STE) ; port JP_CONN.P5.3/UCB1CLK/UCA1STE  [project net JP.P5.3/UCB1CLK/UCA1STE]
P5.7/TBOUTH/SVSOUT: U3.51(P5.7/TBOUTH/SVSOUT) ; port FLASH_HOLD  [project net FLASH_HOLD]
~{RESET}: C20.1 R9.1 S2.1 U3.58(~{RST}/NMI) ; port ~{RESET}  [project net GP2/T0CKI]
SCL: U3.46(P5.2/UCB1SOMI/UCB1SCL) ; port I2C.SCL  [project net I2C.SCL]
SDA: U3.45(P5.1/UCB1SIMO/UCB1SDA) ; port I2C.SDA  [project net I2C.SDA]
UART0.RX: U3.33(P3.5/UCA0RXD/UCA0SOMI) ; port UART0.RX
UART0.TX: U3.32(P3.4/UCA0TXD/UCA0SIMO) ; port UART0.TX
UART1.RX: U3.35(P3.7/UCA1RXD/UCA1SOMI) ; port UART1.RX
UART1.TX: U3.34(P3.6/UCA1TXD/UCA1SIMO) ; port UART1.TX
VeREF+/DAC0: R10.1 R11.2 U3.10(VeREF+/DAC0)
VREF+: C27.2 U3.7(VREF+)
XIN: C7.2 U3.8(XIN) Y2.1(OSC1)
XOUT: C8.2 U3.9(XOUT) Y2.2(OSC2)
XT2IN: U3.53(XT2IN)
XT2OUT: U3.52(XT2OUT)

### Buses and harness runs
bus ADC_[0..7] = port AD_[0..7]
bus LED[1..3] = port LED_[1..3]

### Notes on the sheet
- 1
- (near C25) 1
- 2
- (near U3) VREF-/VeREF-
- 3
- (near R2) 4
- 1. MSP430F2617:  92KB+256B Flash, 8KB RAM.Voltage Range: 1.8V to 3.6V
  2. 32K Crystal Oscillator
  3. 2 avaliable pushbuttons: Reset and User interrupt.
  Various Harness Connectors in the sheet:
  - JP_CONN: Connectios that use for external I/O Functions
  - RADIO: Pins that must be used in radio communication.
  - JTAG: JTAG Programmer/Debugger crictuit for MSP430.
  - SPI, I2C, UART0,1 Serial Communication.
  4. R2 could be used for Rosc. In this case, R2 = 2K2.
- 1.
- 1.  Place close to microcontroller as posible.

### Library data of the parts
C1 C6-C8 C20 C26 C27 = Cap Semi: Capacitor (Semiconductor SIM Model)
C22 C25 = Cap Semi: CAP CER 10UF 6.3V X5R 0603
R2 = Res Semi: as R12 on sheet Main Board
R9-R11 R13 R14 = Res Semi: Semiconductor Resistor
S1 S2 = B3U-1000P: Ultra-small Tactile Switch
U3 = MSP430F2617TPMR: MSP430F2617TPMR MICROCONTROLLER
Y2 = XTAL: Crystal Oscillator; Manufacturer: Generic Components; Value: 32Khz

## Sheet Temp.SchDoc: Temperature sensor
size A4; SheetNumber: 5; SheetTotal: 10; Project: WSN Z1; Comments: Temperatire sensor
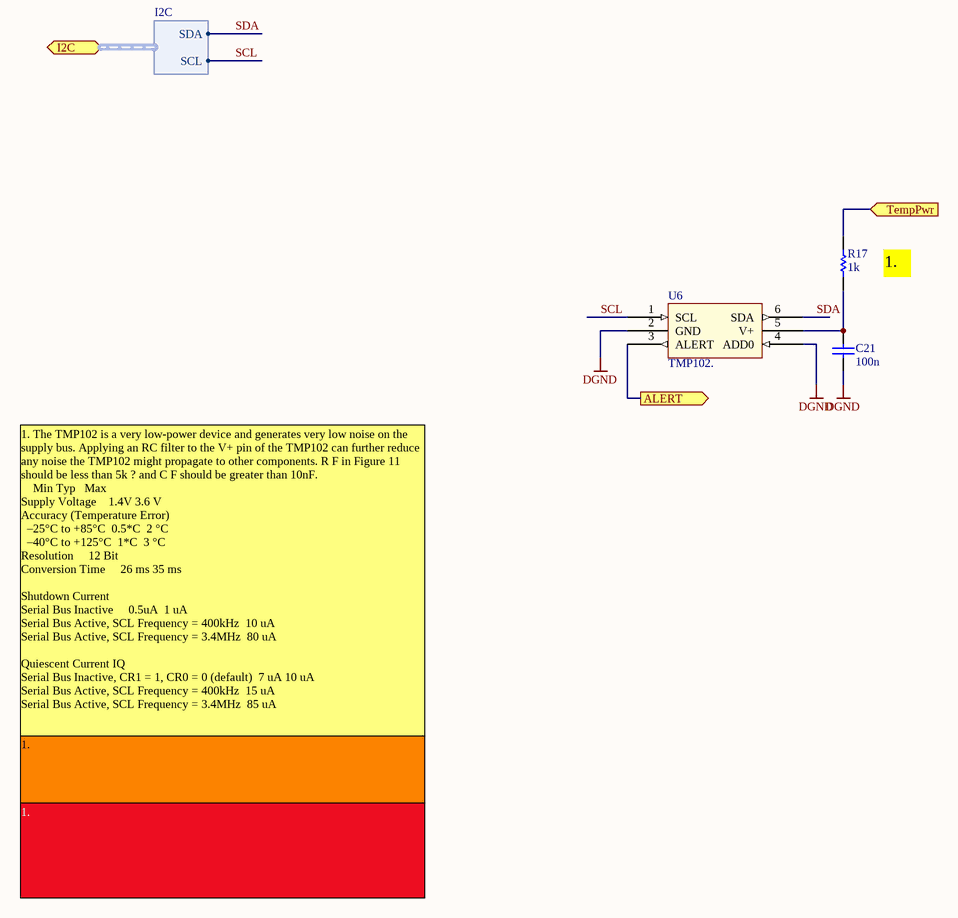
[diagram p5: Temp.SchDoc]

### Parts
C21  value 100n  [CC-0402-AL]  (hidden comment: Cap Semi)
R17  value 1k  [CR-0402-AL]  (hidden comment: Res Semi)
U6  TMP102.  [SOT-TMP102]

### Ports
ALERT (out), I2C (harness I2C), TempPwr (in)

### Harnesses
I2C: SCL, SDA

### Nets
DGND: C21.2 U6.2(GND) U6.4(ADD0)
ALERT: U6.3(ALERT) ; port ALERT
P5.0/UCB1STE/UCA1CLK: R17.2 ; port TempPwr
SCL: U6.1(SCL) ; port I2C.SCL  [project net I2C.SCL]
SDA: U6.6(SDA) ; port I2C.SDA  [project net I2C.SDA]
NetC21_1: C21.1 R17.1 U6.5(V+)

### Notes on the sheet
- (near R17) 1.
- 1. The TMP102 is a very low-power device and generates very low noise on the supply bus. Applying an RC filter to the V+ pin of the TMP102 can further reduce any noise the TMP102 might propagate to other components. R F in Figure 11 should be less than 5k ? and C F should be greater than 10nF.
  Min	Typ  	Max
  Supply Voltage 			1.4V	3.6 V
  Accuracy (Temperature Error)
  –25°C to +85°C		0.5*C 	2 °C
  –40°C to +125°C		1*C 	3 °C
  Resolution 				12 Bit
  Conversion Time 				26 ms	35 ms
  Shutdown Current
  Serial Bus Inactive 				0.5uA 	1 uA
  Serial Bus Active, SCL Frequency = 400kHz 	10 uA
  Serial Bus Active, SCL Frequency = 3.4MHz 	80 uA
  Quiescent Current IQ
  Serial Bus Inactive, CR1 = 1, CR0 = 0 (default) 	7 uA	10 uA
  Serial Bus Active, SCL Frequency = 400kHz 	15 uA
  Serial Bus Active, SCL Frequency = 3.4MHz 	85 uA
- 1.

### Library data of the parts
C21 = Cap Semi: Capacitor (Semiconductor SIM Model)
R17 = Res Semi: as R12 on sheet Main Board
U6 = TMP102: Low Power Digital Temperature Sensor  With SMBus /Two-Wire Serial Interface in SOT563. Voltage Supply 1.4 V ~ 3.6 V

## Sheet USB Interface.SchDoc: USB Interface
size A4; SheetNumber: 4; SheetTotal: 10; Project: WSN Z1; Comments: CP2102
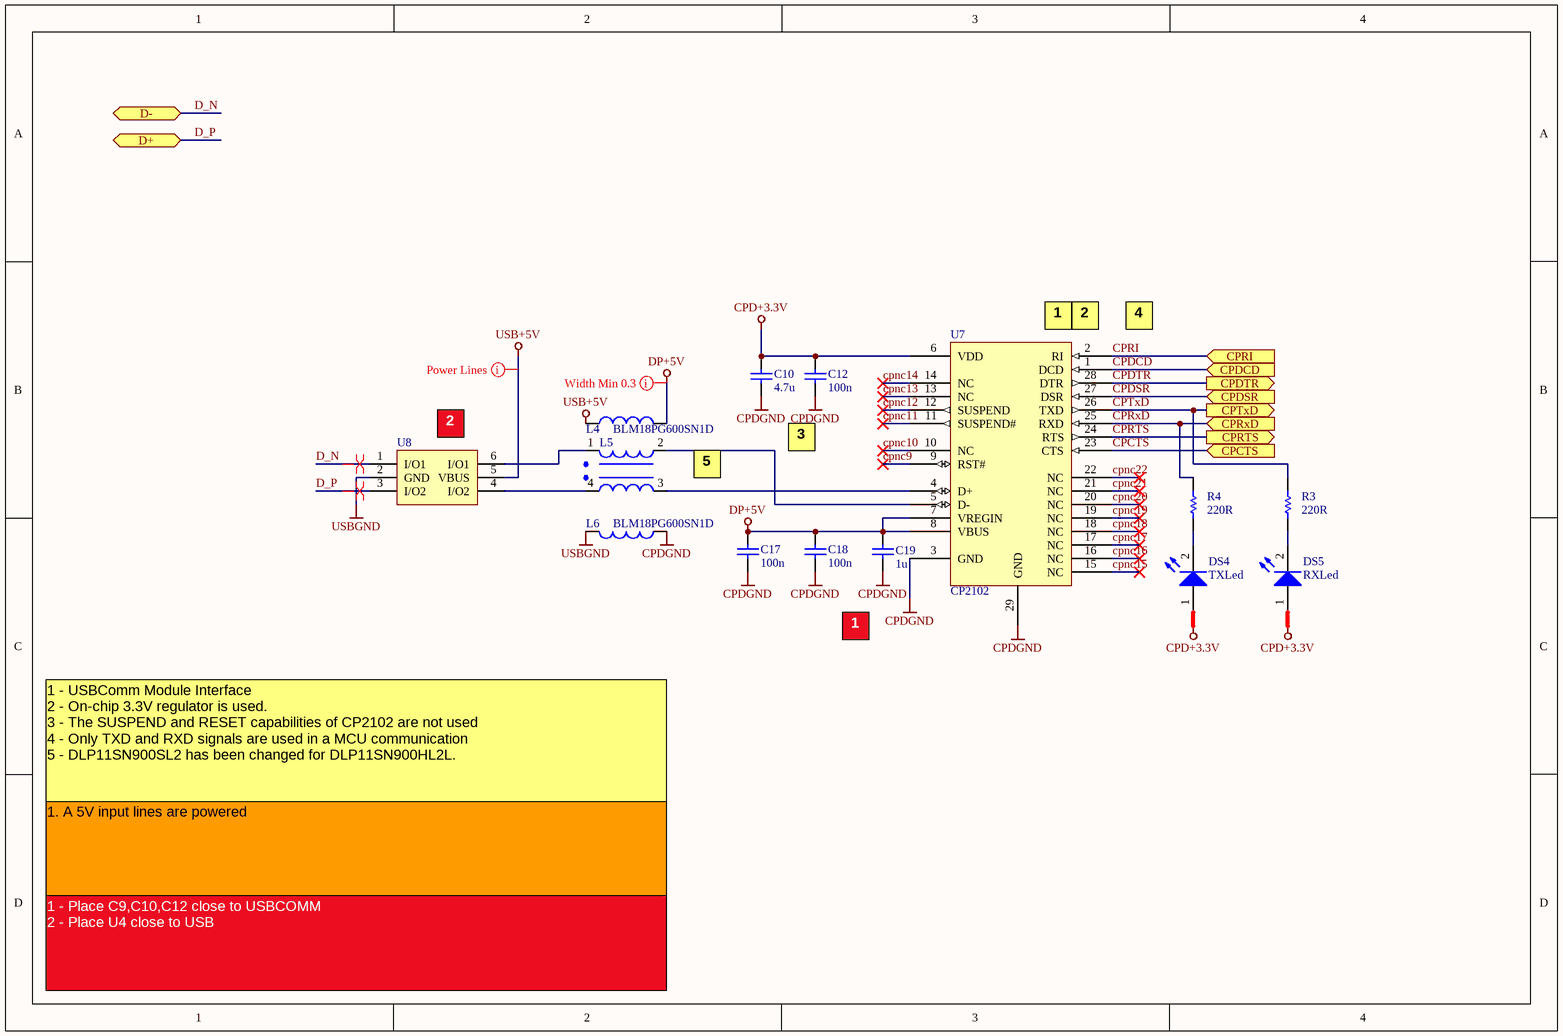
[diagram p6: USB Interface.SchDoc]

### Parts
C10  value 4.7u  [CC1608-0603]  (hidden comment: Cap Semi)
C12  value 100n  [CC-0402-AL]  (hidden comment: Cap Semi)
C17  value 100n  [CC-0402-AL]  (hidden comment: Cap Semi)
C18  value 100n  [CC-0402-AL]  (hidden comment: Cap Semi)
C19  value 1u  [CC1005-0402]  (hidden comment: USB bus decoupling)
DS4  TXLed  [LED0603]
DS5  RXLed  [LED0603]
L4  value BLM18PG600SN1D  [INDC1608-0603]  (hidden comment: Inductor)
L5  DLP11SN900HL2L  [inductor-4pins]  (value not drawn)
L6  value BLM18PG600SN1D  [INDC1608-0603]  (hidden comment: Inductor)
R3  value 220R  [CR-0402-AL]  (hidden comment: Res Semi)
R4  value 220R  [CR-0402-AL]  (hidden comment: Res Semi)
U7  CP2102  [MLP-28]
U8  ESD protection  [SO-G6/E2.4]  (value not drawn)

### Ports
CPCTS (in), CPDCD (in), CPDSR (in), CPDTR (out), CPRI (in), CPRTS (out), CPRxD (in), CPTxD (out), D+ (bidir), D- (bidir)

### Nets
CPD+3.3V: C10.2 C12.1 DS4.1(A) DS5.1(A) U7.6(VDD)
CPDGND: C10.1 C12.2 C17.2 C18.2 C19.2 L6.1 U7.3(GND) U7.29(GND)
DP+5V: C17.1 C18.1 C19.1 L4.2 U7.7(VREGIN) U7.8(VBUS)
USB+5V: L4.1 U8.5(VBUS)
USBGND: L6.2 U8.2(GND)
CPCTS: U7.23(CTS) ; port CPCTS
CPDCD: U7.1(DCD) ; port CPDCD
CPDSR: U7.27(DSR) ; port CPDSR
CPDTR: U7.28(DTR) ; port CPDTR
cpnc9: U7.9(RST#)
cpnc10: U7.10(NC)
cpnc11: U7.11(SUSPEND#)
cpnc12: U7.12(SUSPEND)
cpnc13: U7.13(NC)
cpnc14: U7.14(NC)
cpnc15: U7.15(NC)
cpnc16: U7.16(NC)
cpnc17: U7.17(NC)
cpnc18: U7.18(NC)
cpnc19: U7.19(NC)
cpnc20: U7.20(NC)
cpnc21: U7.21(NC)
cpnc22: U7.22(NC)
CPRI: U7.2(RI) ; port CPRI
CPRTS: U7.24(RTS) ; port CPRTS
CPRxD: R4.2 U7.25(RXD) ; port CPRxD
CPTxD: R3.2 U7.26(TXD) ; port CPTxD
D_N: U8.1(I/O1) ; port D-
D_P: U8.3(I/O2) ; port D+
NetDS4_2: DS4.2(K) R4.1
NetDS5_2: DS5.2(K) R3.1
NetL5_1: L5.1 U8.6(I/O1)
NetL5_2: L5.2 U7.5(D-)
NetL5_3: L5.3 U7.4(D+)
NetL5_4: L5.4 U8.4(I/O2)

### Layout directives
rule Width Constraint [Pref Width = 0.3mm    Min Width = 0.3mm    Max Width = 1mm]: DP+5V
differential pair; rule Differential Pairs Routing [Pref Gap = 0.2mm    Min Gap  = 0.15mm    Max Gap  = 5mm]; rule Width Constraint [Pref Width = 0.2mm    Min Width = 0.15mm    Max Width = 0.8mm]: D_N
differential pair; rule Differential Pairs Routing [Pref Gap = 0.254mm    Min Gap  = 0.15mm    Max Gap  = 5mm]; rule Width Constraint [Pref Width = 0.2mm    Min Width = 0.15mm    Max Width = 0.85mm]: D_P
net class Power Lines; rule Width Constraint [Pref Width = 0.3mm    Min Width = 0.3mm    Max Width = 0.4mm]; rule Power Plane Connect Style [Style - Relief Connect    Expansion = 0.4mm    Width = 0.2mm    Gap = 0.2mm    # Entries = 4]: USB+5V

### Notes on the sheet
- (near U7) 1
- (near U7) 2
- 4
- (near U8) 2
- 3
- 5
- 1
- 1 - USBComm Module Interface
  2 - On-chip 3.3V regulator is used.
  3 - The SUSPEND and RESET capabilities of CP2102 are not used
  4 - Only TXD and RXD signals are used in a MCU communication
  5 - DLP11SN900SL2 has been changed for DLP11SN900HL2L.
- 1. A 5V input lines are powered
- 1 - Place C9,C10,C12 close to USBCOMM
  2 - Place U4 close to USB

### Library data of the parts
C10 C12 C17 C18 = Cap Semi: Capacitor (Semiconductor SIM Model)
C19 = Cap Semi: Chip capacitor, 0603, Y5V, 10V
DS4 = LED2: LED 1.6X0.8MM 589NM YEL CLR SMD
DS5 = LED2: LED 1.6X0.8MM 605NM ORNG CLR SMD
L5 = DLP11SN900SL2: Choke Coil Common Mode 150mA SMD
R3 R4 = Res Semi: as R12 on sheet Main Board
U7 = CP2102: USB-to-Serial Converter from Silicon Laboratories; pin to pad: 29>3
U8 = USBLC6-2SC6: VERY LOW CAPACITANCE  ESD PROTECTION

## Sheet Accelerometer.SchDoc: Accelerometer
size A4; SheetNumber: 6; SheetTotal: 10; Project: WSN Z1; Comments: Accelerometer
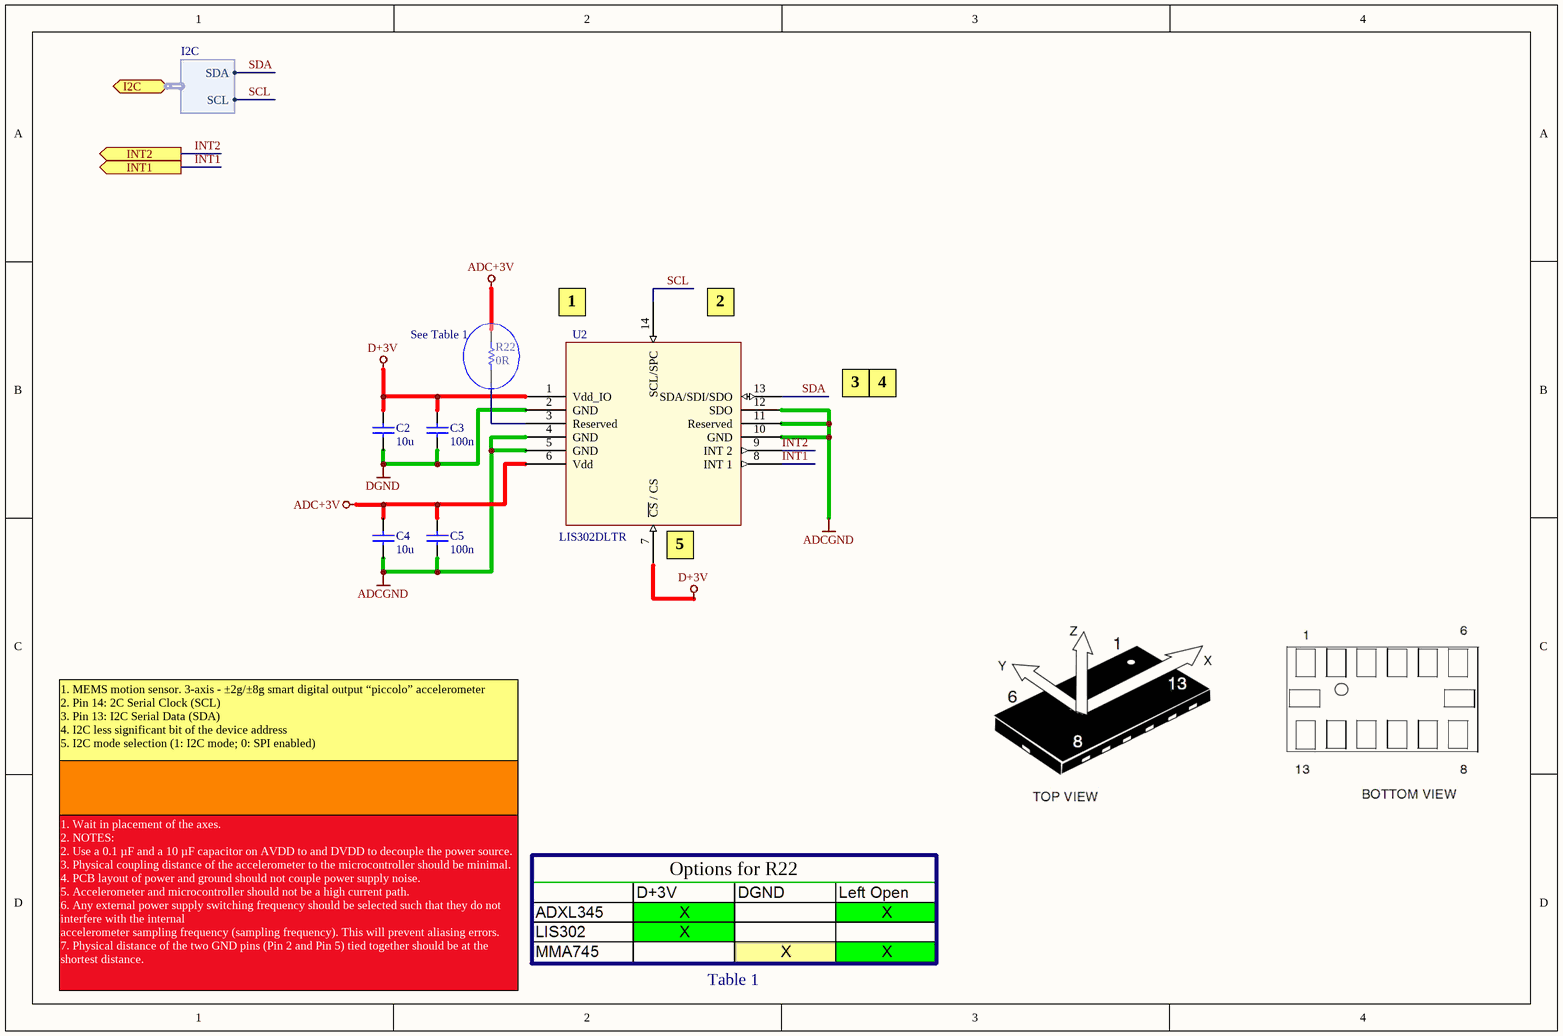
[diagram p7: Accelerometer.SchDoc]

### Parts
C2  value 10u  [CC1608-0603]  (hidden comment: Cap Semi)
C3  value 100n  [CC-0402-AL]  (hidden comment: Cap Semi)
C4  value 10u  [CC1608-0603]  (hidden comment: Cap Semi)
C5  value 100n  [CC-0402-AL]  (hidden comment: Cap Semi)
R22  value 0R  [CR-0402-AL]  (hidden comment: Res Semi)
U2  LIS302DLTR  [LGA-3x5x1 0.8 - 1.5]

### Ports
I2C (harness I2C), INT1 (out), INT2 (out)

### Harnesses
I2C: SCL, SDA

### Nets
ADC+3V: C4.2 C5.2 R22.2 U2.6(Vdd)
ADCGND: C4.1 C5.1 U2.4(GND) U2.5(GND) U2.10(GND) U2.11(Reserved) U2.12(SDO)
D+3V: C2.2 C3.2 U2.1(Vdd_IO) U2.7(~{CS}_/_CS)
DGND: C2.1 C3.1 U2.2(GND)
INT1: U2.8(INT_1) ; port INT1
INT2: U2.9(INT_2) ; port INT2
SCL: U2.14(SCL/SPC) ; port I2C.SCL  [project net I2C.SCL]
SDA: U2.13(SDA/SDI/SDO) ; port I2C.SDA  [project net I2C.SDA]
NetR22_1: R22.1 U2.3(Reserved)

### Notes on the sheet
- (near U2) 1
- (near U2) 2
- (near R22) See Table 1
- 3
- 4
- (near U2) 5
- 1. MEMS motion sensor. 3-axis - ±2g/±8g smart digital output “piccolo” accelerometer
  2. Pin 14: 2C Serial Clock (SCL)
  3. Pin 13: I2C Serial Data (SDA)
  4. I2C less significant bit of the device address
  5. I2C mode selection (1: I2C mode; 0: SPI enabled)
- Options for R22
- 1. Wait in placement of the axes.
  2. NOTES:
  2. Use a 0.1 µF and a 10 µF capacitor on AVDD to and DVDD to decouple the power source.
  3. Physical coupling distance of the accelerometer to the microcontroller should be minimal.
  4. PCB layout of power and ground should not couple power supply noise.
  5. Accelerometer and microcontroller should not be a high current path.
  6. Any external power supply switching frequency should be selected such that they do not interfere with the internal
  accelerometer sampling frequency (sampling frequency). This will prevent aliasing errors.
  7. Physical distance of the two GND pins (Pin 2 and Pin 5) tied together should be at the shortest distance.
- Table 1

### Library data of the parts
C2 C4 = Cap Semi: CAP CER 10UF 6.3V X5R 0603
C3 C5 = Cap Semi: Capacitor (Semiconductor SIM Model)
R22 = Res Semi: as R12 on sheet Main Board
U2 = LIS302DL: MEMS motion sensor  3-axis - ±2g/±8g smart digital output “piccolo” accelerometer

## Sheet PIC_BSL.SchDoc: Bootstrap and reset detector
size A4; SheetNumber: 9; SheetTotal: 10; Project: WSN Z1; Comments: Pic with comm
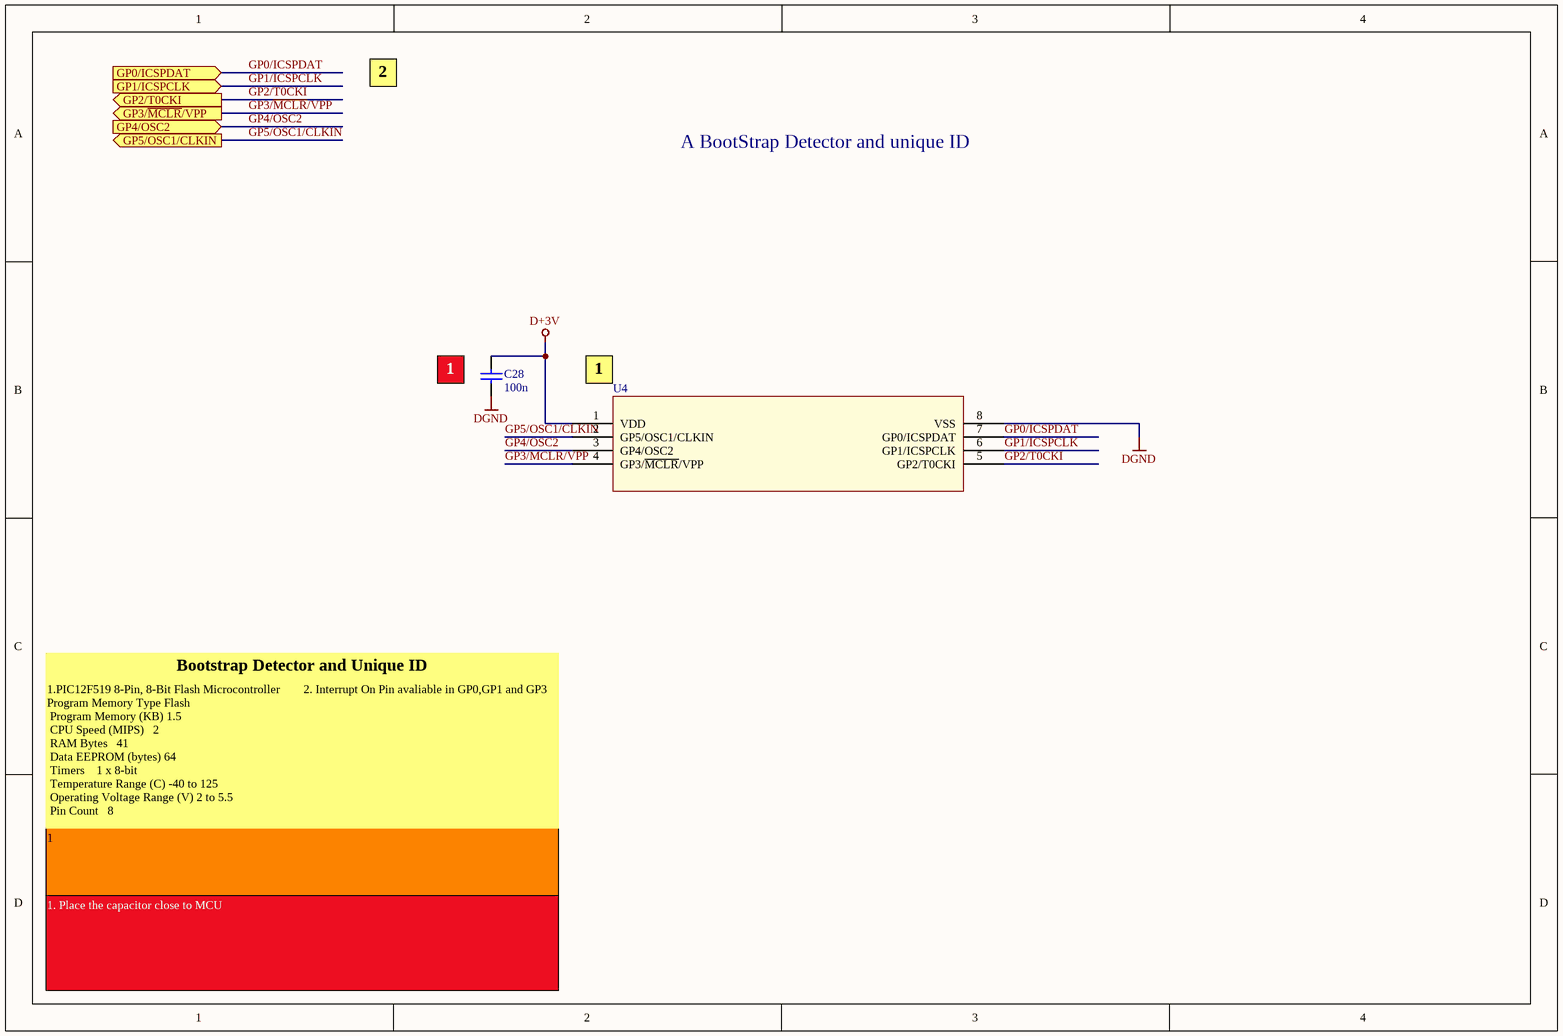
[diagram p8: PIC_BSL.SchDoc]

### Parts
C28  value 100n  [CC1005-0402]  (hidden comment: Cap Semi)
U4  8-Bit CMOS Microcontroller  [DFN 2x3x0.9mm]  (value not drawn)

### Ports
GP0/ICSPDAT (in), GP1/ICSPCLK (in), GP2/T0CKI (out), GP3/~{MCLR}/VPP (out), GP4/OSC2 (in), GP5/OSC1/CLKIN (out)

### Nets
D+3V: C28.2 U4.1(VDD)
DGND: C28.1 U4.8(VSS)
GP0/ICSPDAT: U4.7(GP0/ICSPDAT) ; port GP0/ICSPDAT
GP1/ICSPCLK: U4.6(GP1/ICSPCLK) ; port GP1/ICSPCLK  [project net CPDTR]
GP2/T0CKI: U4.5(GP2/T0CKI) ; port GP2/T0CKI
GP3/~{MCLR}/VPP: U4.4(GP3/~{MCLR}/VPP) ; port GP3/~{MCLR}/VPP
GP4/OSC2: U4.3(GP4/OSC2) ; port GP4/OSC2  [project net CPRTS]
GP5/OSC1/CLKIN: U4.2(GP5/OSC1/CLKIN) ; port GP5/OSC1/CLKIN

### Notes on the sheet
- 2
- A BootStrap Detector and unique ID
- (near C28) 1
- (near U4) 1
- Bootstrap Detector and Unique ID
- 1.PIC12F519 8-Pin, 8-Bit Flash Microcontroller
  Program Memory Type	Flash
  Program Memory (KB)	1.5
  CPU Speed (MIPS)	 	2
  RAM Bytes	 	41
  Data EEPROM (bytes)	64
  Timers	 		1 x 8-bit
  Temperature Range (C)	-40 to 125
  Operating Voltage Range (V)	2 to 5.5
  Pin Count			8
- 2. Interrupt On Pin avaliable in GP0,GP1 and GP3
- 1
- 1. Place the capacitor close to MCU

### Library data of the parts
C28 = Cap Semi: Capacitor (Semiconductor SIM Model)
U4 = PIC12F589: 8-Bit CMOS Microcontroller, Program Memory (KB)  1.5,  RAM Bytes  41, Data EEPROM (bytes)  64,  Pin Count  8

## Sheet Power Supply.SchDoc: Power Supply
size A4; SheetNumber: 8; SheetTotal: 10; Project: WSN Z1; Comments: Power Supply
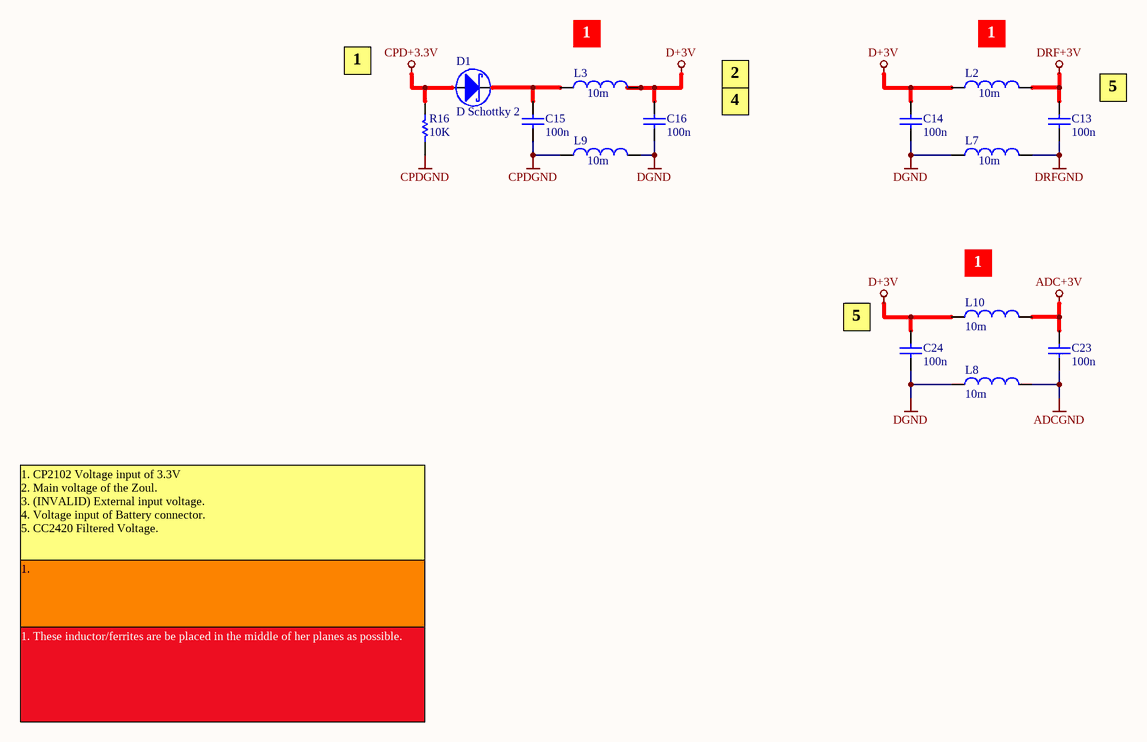
[diagram p9: Power Supply.SchDoc]

### Parts
C13  value 100n  [CC-0402-AL]  (hidden comment: Cap Semi)
C14  value 100n  [CC-0402-AL]  (hidden comment: Cap Semi)
C15  value 100n  [CC-0402-AL]  (hidden comment: Cap Semi)
C16  value 100n  [CC-0402-AL]  (hidden comment: Cap Semi)
C23  value 100n  [CC-0402-AL]  (hidden comment: Cap Semi)
C24  value 100n  [CC-0402-AL]  (hidden comment: Cap Semi)
D1  D Schottky 2  [STPS140A]
L2  value 10m  [CR-0402-AL]  (hidden comment: Inductor)
L3  value 10m  [CR-0402-AL]  (hidden comment: Inductor)
L7  value 10m  [CR-0402-AL]  (hidden comment: Inductor)
L8  value 10m  [CR-0402-AL]  (hidden comment: Inductor)
L9  value 10m  [CR-0402-AL]  (hidden comment: Inductor)
L10  value 10m  [CR-0402-AL]  (hidden comment: Inductor)
R16  value 10K  [CR-0402-AL]  (hidden comment: Res Semi)

### Nets
ADC+3V: C23.2 L10.1
ADCGND: C23.1 L8.1
CPD+3.3V: D1.1(A) R16.1
CPDGND: C15.2 L9.1 R16.2
D+3V: C14.2 C16.1 C24.1 L2.1 L3.2 L10.2
DGND: C14.1 C16.2 C24.2 L7.1 L8.2 L9.2
DRF+3V: C13.1 L2.2
DRFGND: C13.2 L7.2
NetC15_1: C15.1 D1.2(K) L3.1

### Notes on the sheet
- (near L3) 1
- (near L2) 1
- 1
- 4
- 2
- (near C13) 5
- (near L10) 1
- (near C24) 5
- 1. CP2102 Voltage input of 3.3V
  2. Main voltage of the Zoul.
  3. (INVALID) External input voltage.
  4. Voltage input of Battery connector.
  5. CC2420 Filtered Voltage.
- 1.
- 1. These inductor/ferrites are be placed in the middle of her planes as possible.

### Library data of the parts
C13-C16 C23 C24 = Cap Semi: Capacitor (Semiconductor SIM Model)
D1 = D Schottky 2: Schotkky Diode 1N5820
R16 = Res Semi: as R12 on sheet Main Board

## Nets that join several sheets
ADC+3V: Main Board (JP1.4 JP1.14), MCU (C6.1 C22.1 U3.64), Accelerometer (C4.2 C5.2 R22.2 U2.6), Power Supply (C23.2 L10.1)
ADCGND: Main Board (6 pins), MCU (6 pins), Accelerometer (7 pins), Power Supply (C23.1 L8.1)
CPD+3.3V: Main Board (JP1.20), memory (U5.3), MCU (R14.1), USB Interface (5 pins), Power Supply (D1.1 R16.1)
CPDGND: Main Board (JP1.18), USB Interface (8 pins), Power Supply (C15.2 L9.1 R16.2)
D+3V: Main Board (6 pins), LED (DS1.1 DS2.1 DS3.1), memory (C9.2 U5.8), MCU (6 pins), Accelerometer (C2.2 C3.2 U2.1 U2.7), PIC_BSL (C28.2 U4.1), Power Supply (6 pins)
DGND: Main Board (6 pins), memory (C9.1 U5.4), MCU (9 pins), Temp (C21.2 U6.2 U6.4), Accelerometer (C2.1 C3.1 U2.2), PIC_BSL (C28.1 U4.8), Power Supply (6 pins)
DRF+3V: RF (5 pins), Power Supply (C13.1 L2.2)
DRFGND: Main Board (X1.2), RF (24 pins), Power Supply (C13.2 L7.2)
USB+5V: Main Board (JP1.3 JP1.13 JP1.23 JP2.1), USB Interface (L4.1 U8.5)
USBGND: Main Board (JP1.17 JP2.5), USB Interface (L6.2 U8.2)
AD_0: Main Board (R20.1 R21.2), MCU (R10.2 U3.59)
AD_1: Main Board (JP1.16), MCU (U3.60)
AD_2: Main Board (JP1.9), MCU (U3.61)
AD_3: Main Board (R12.1 R15.2), MCU (U3.2)
AD_4: Main Board (JP1.7), MCU (U3.3)
AD_5: Main Board (JP1.10), MCU (U3.4)
AD_6: Main Board (JP1.8), MCU (U3.5)
AD_7: Main Board (JP1.6), MCU (U3.6)
ALERT: Main Board (JP1.41), MCU (U3.27), Temp (U6.3)
BSL_RX: Main Board (JP1.47 R19.2), MCU (U3.22)
BSL_TX: Main Board (JP1.53 R18.2), MCU (U3.13)
Ceramic Antenna: Main Board (L1.1), RF (C62.3)
CPCTS: Main Board (R23.1), USB Interface (U7.23)
CPDCD: Main Board (R24.1), USB Interface (U7.1)
CPDSR: Main Board (R25.1), USB Interface (U7.27)
CPDTR: Main Board (JP1.59), USB Interface (U7.28), PIC_BSL (U4.6)
CPRI: Main Board (R26.1), USB Interface (U7.2)
CPRTS: USB Interface (U7.24), PIC_BSL (U4.3)
CPRxD: Main Board (JP1.37 R18.1), USB Interface (R4.2 U7.25)
CPTxD: Main Board (JP1.35 R19.1), USB Interface (R3.2 U7.26)
D_N: Main Board (JP1.21 JP2.2), USB Interface (U8.1)
D_P: Main Board (JP1.19 JP2.3), USB Interface (U8.3)
FLASH_CS: memory (U5.1), MCU (U3.40)
FLASH_HOLD: memory (U5.7), MCU (U3.51)
GP0/ICSPDAT: Main Board (6 pins), MCU (R13.2 U3.24), PIC_BSL (U4.7)
GP2/T0CKI: Main Board (JP1.66), MCU (C20.1 R9.1 S2.1 U3.58), PIC_BSL (U4.5)
GP3/~{MCLR}/VPP: Main Board (JP1.55), PIC_BSL (U4.4)
GP5/OSC1/CLKIN: Main Board (JP1.64), PIC_BSL (U4.2)
I2C.SCL: MCU (U3.46), Temp (U6.1), Accelerometer (U2.14)
I2C.SDA: MCU (U3.45), Temp (U6.6), Accelerometer (U2.13)
INT1: Main Board (JP1.52), MCU (U3.18), Accelerometer (U2.8)
INT2: Main Board (JP1.50), MCU (U3.19), Accelerometer (U2.9)
LED1: LED (R6.1), MCU (U3.48)
LED2: LED (R7.2), MCU (U3.50)
LED3: LED (R8.2), MCU (U3.49)
P1.2/TA1: RF (U1.29), MCU (U3.14)
P1.3/TA2: RF (U1.30), MCU (U3.15)
P1.4/SMCLK: RF (U1.28), MCU (U3.16)
P2.5/ROSC/CA5: Main Board (JP1.44), MCU (C1.1 R2.2 S1.1 U3.25)
P3.0/UCB0STE/UCA0CLK: RF (U1.31), MCU (U3.28)
P3.1/UCB0SIMO/UCB0SDA: RF (U1.33), memory (U5.5), MCU (U3.29)
P3.2/UCB0SOMI/UCB0SCL: RF (U1.34), memory (U5.2), MCU (U3.30)
P3.3/UCB0CLK/UCA0STE: RF (U1.32), memory (U5.6), MCU (U3.31)
P4.1/TB1: RF (U1.27), MCU (U3.37)
P4.5/TB5: RF (R1.2 U1.41), MCU (U3.41)
P4.6/TB6: RF (R5.2 U1.21), MCU (U3.42)
P5.0/UCB1STE/UCA1CLK: Main Board (JP1.25), MCU (U3.44), Temp (R17.2)
U.FL Antenna: Main Board (X1.1), RF (C62.2)